# EAGLE schematic addressdecoder (EAGLE 6.4)
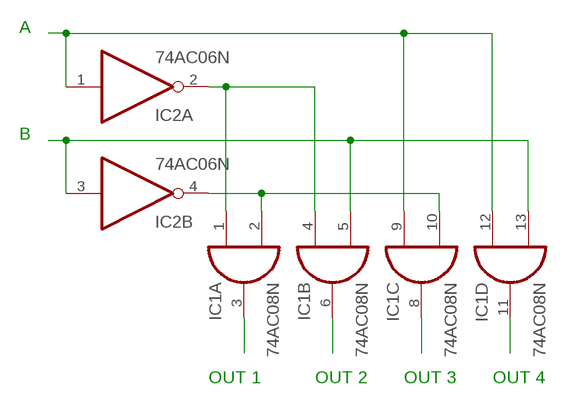
[diagram p0: schematic, sheet 1]

## Parts
IC1  74AC08N  [DIL14]
IC2  74AC06N  [DIL14]

## Nets
N$1: IC1.9(C:I0) IC1.12(D:I0) IC2.1(A:I)
N$2: IC1.5(B:I1) IC1.13(D:I1) IC2.3(B:I)
N$3: IC1.1(A:I0) IC1.4(B:I0) IC2.2(A:O)
N$4: IC1.2(A:I1) IC1.10(C:I1) IC2.4(B:O)
N$5: IC1.8(C:O)
N$6: IC1.3(A:O)
N$7: IC1.6(B:O)
N$8: IC1.11(D:O)
Unconnected: IC2.5(C:I) IC2.6(C:O) IC2.8(D:O) IC2.9(D:I) IC2.10(E:O) IC2.11(E:I) IC2.12(F:O) IC2.13(F:I)

## Notes on the sheet
- A
- B
- OUT 1 | OUT 2 | OUT 3 | OUT 4

## Power pins joined to a net without a drawn wire
GND: IC1.7(P:GND) IC2.7(P:GND)
VCC: IC1.14(P:VCC) IC2.14(P:VCC)

## Library data of the parts
IC1 = 74xx-eu:74*08: Quad 2-input AND gate
IC2 = 74xx-eu:74*06: Hex INVERTER, open collector high-voltage output